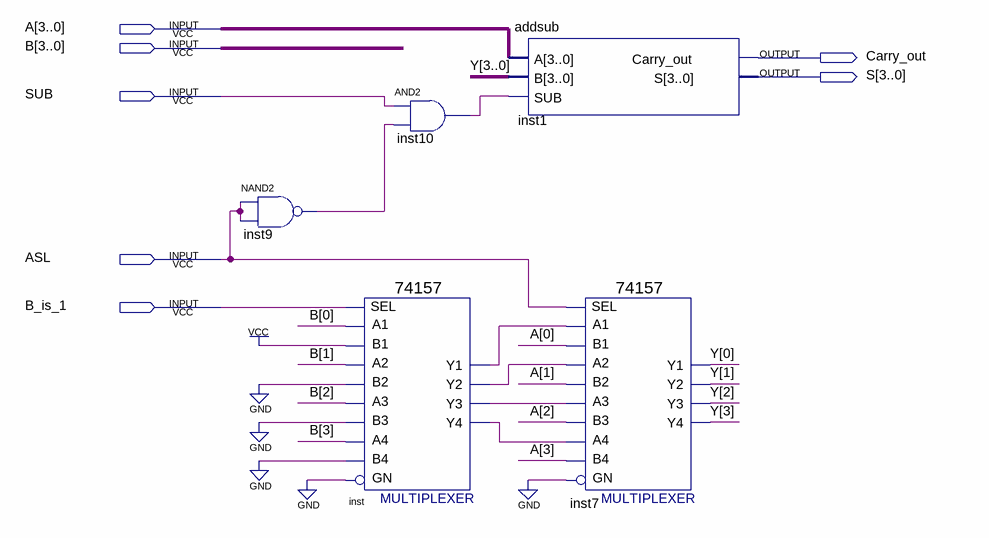
[diagram p0: schematic sheet]
// Quartus schematic extALU.bdf as structural Verilog: 5 symbols, 7 pins
module extALU (
  input  [3:0] A,
  input  [3:0] B,
  input  SUB,
  input  ASL,
  input  B_is_1,
  output Carry_out,
  output [3:0] S
);

  wire inst9_out, inst10_out, inst_y1, inst_y2, inst_y3, inst_y4;
  wire [3:0] Y;

  nand inst9 (inst9_out, ASL, ASL);
  and inst10 (inst10_out, SUB, inst9_out);
  \74157  inst (
    .A1(B[0]), .B1(1'b1), .SEL(B_is_1), .B2(1'b0), .A3(B[2]), .B3(1'b0), .A2(B[1]), .B4(1'b0), .GN(1'b0),
    .A4(B[3]), .Y2(inst_y2), .Y1(inst_y1), .Y4(inst_y4), .Y3(inst_y3));
  addsub inst1 (.A(A), .B(Y), .SUB(inst10_out), .Carry_out(Carry_out), .S(S));
  \74157  inst7 (
    .A1(inst_y1), .B1(A[0]), .SEL(ASL), .B2(A[1]), .A3(inst_y3), .B3(A[2]), .A2(inst_y2), .B4(A[3]),
    .GN(1'b0), .A4(inst_y4), .Y2(Y[1]), .Y1(Y[0]), .Y4(Y[3]), .Y3(Y[2]));
endmodule
